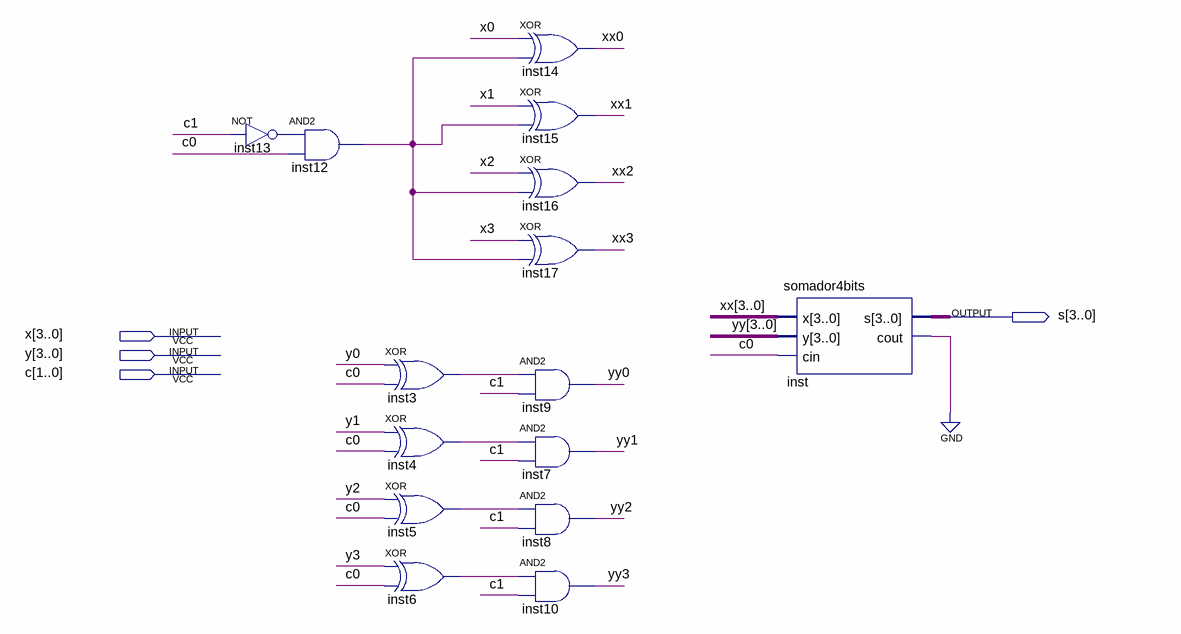
[diagram p0: schematic sheet]
// Quartus schematic ULA4bits.bdf as structural Verilog: 15 symbols, 4 pins
module ULA4bits (
  input  [3:0] x,
  input  [3:0] y,
  input  [1:0] c,
  output [3:0] s
);

  wire inst3_out, inst4_out, inst5_out, inst6_out, inst12_out, inst13_out, inst_cout;
  wire [3:0] xx, yy;

  and inst12 (inst12_out, inst13_out, c[0]);
  not inst13 (inst13_out, c[1]);
  xor inst3 (inst3_out, y[0], c[0]);
  xor inst4 (inst4_out, y[1], c[0]);
  xor inst5 (inst5_out, y[2], c[0]);
  xor inst6 (inst6_out, y[3], c[0]);
  xor inst14 (xx[0], x[0], inst12_out);
  xor inst15 (xx[1], x[1], inst12_out);
  xor inst16 (xx[2], x[2], inst12_out);
  xor inst17 (xx[3], x[3], inst12_out);
  and inst9 (yy[0], inst3_out, c[1]);
  and inst7 (yy[1], inst4_out, c[1]);
  and inst8 (yy[2], inst5_out, c[1]);
  and inst10 (yy[3], inst6_out, c[1]);
  somador4bits inst (.x(xx), .y(yy), .cin(c[0]), .s(s), .cout(inst_cout));
  // also tied to GND on the sheet: inst_cout
endmodule
